# Altium schematic sheet MMC_2_2_MCU.SchDoc
size A4
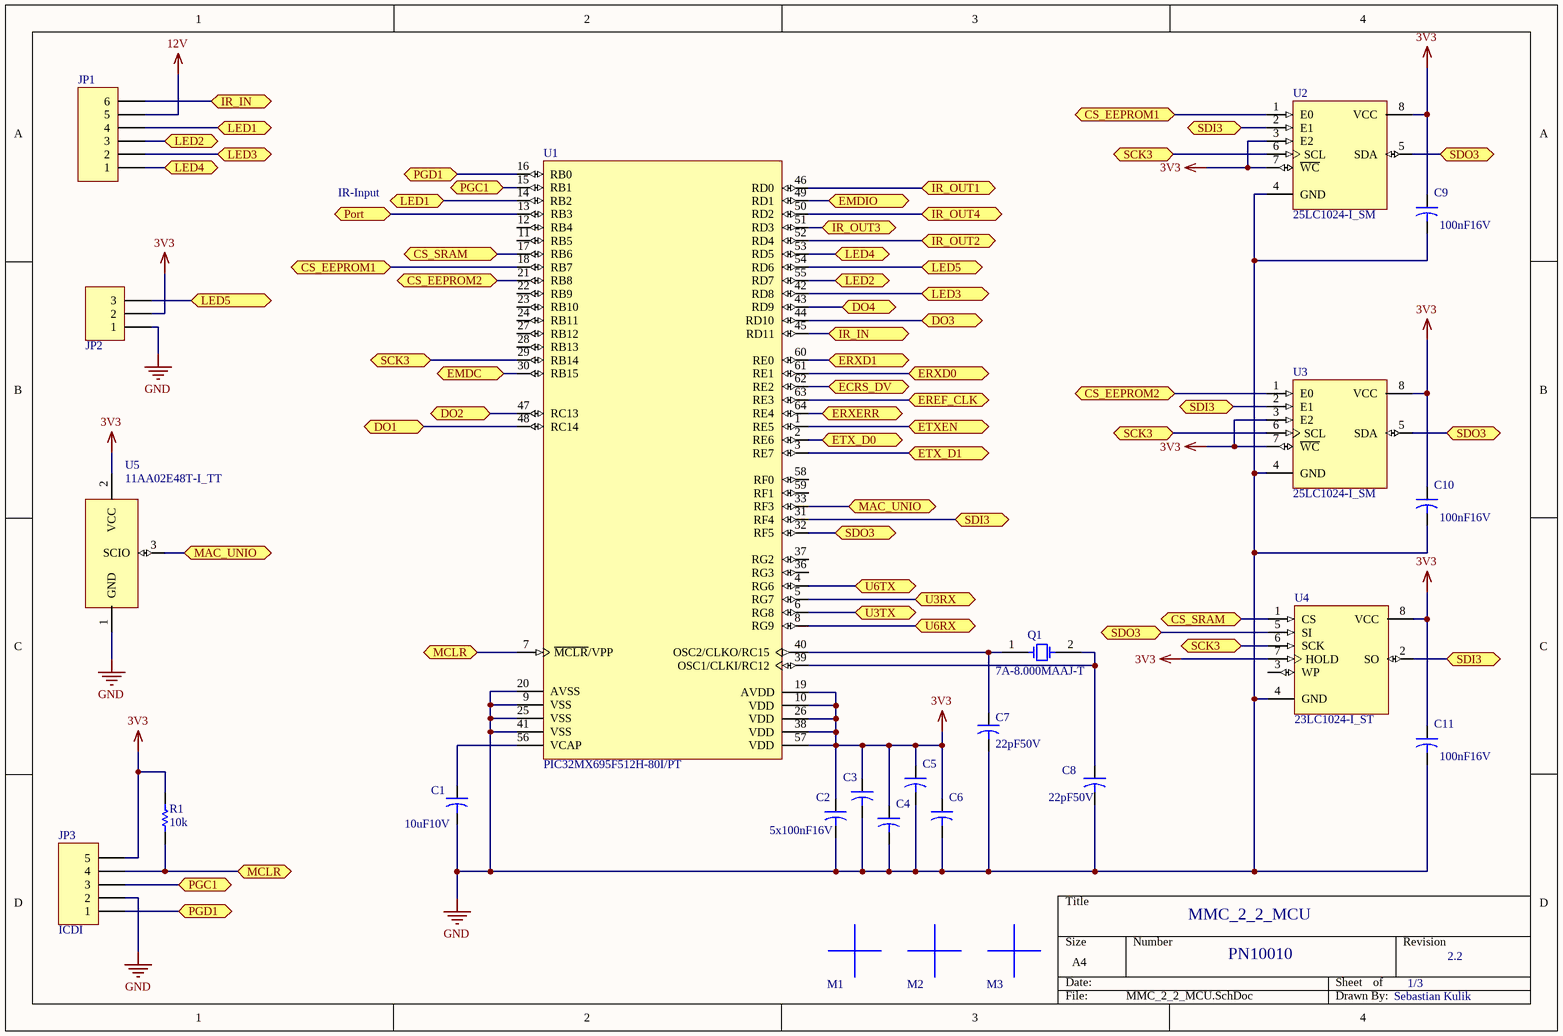
[diagram p0: MMC_2_2_MCU.SchDoc]

## Parts
C1  value 10uF10V  [C0603]  (hidden comment: 10uF10V_0603)
C2  100nF16V_0402  [C0402]  (value not drawn)
C3  100nF16V_0402  [C0402]  (value not drawn)
C4  100nF16V_0402  [C0402]  (value not drawn)
C5  100nF16V_0402  [C0402]  (value not drawn)
C6  100nF16V_0402  [C0402]  (value not drawn)
C7  value 22pF50V  [C0402]  (hidden comment: 22pF50V_0402)
C8  value 22pF50V  [C0402]  (hidden comment: 22pF50V_0402)
C9  value 100nF16V  [C0402]  (hidden comment: 100nF16V_0402)
C10  value 100nF16V  [C0402]  (hidden comment: 100nF16V_0402)
C11  value 100nF16V  [C0402]  (hidden comment: 100nF16V_0402)
JP1  Header 6_2.54  [HDR1X6_2.54]  (value not drawn)
JP2  Header-3  [HDR1X3]  (value not drawn)
JP3  ICDI  [HDR1X5-1.27]
M1  Mark  [Mark-3mm]  (value not drawn)
M2  Mark  [Mark-3mm]  (value not drawn)
M3  Mark  [Mark-3mm]  (value not drawn)
Q1  7A-8.000MAAJ-T  [TXC_7A]
R1  value 10k  [R0402]  (hidden comment: 10k_0402)
U1  PIC32MX695F512H-80I/PT  [TQFP-64_N1]
U2  25LC1024-I_SM  [SOP8_N]
U3  25LC1024-I_SM  [SOP8_N]
U4  23LC1024-I_ST  [TSSOP8]
U5  11AA02E48T-I_TT  [SOT23_M]

## Ports
CS_EEPROM1, CS_EEPROM2, CS_SRAM, DO1, DO2, DO3, DO4, ECRS_DV, EMDC, EMDIO, EREF_CLK, ERXD0, ERXD1, ERXERR, ETX_D0, ETX_D1, ETXEN, IR_IN, IR_OUT1, IR_OUT2, IR_OUT3, IR_OUT4, LED1, LED2, LED3, LED4, LED5, MAC_UNIO, MCLR, PGC1, PGD1, Port, SCK3, SDI3, SDO3, U3RX, U3TX, U6RX, U6TX

## Nets
3V3: C2.1 C3.1 C4.1 C5.1 C6.1 C9.1 C10.1 C11.1 JP2.2 JP3.5 R1.2 U1.10(VDD) U1.19(AVDD) U1.26(VDD) U1.38(VDD) U1.57(VDD) U2.3(E2) U2.7(~{WC}) U2.8(VCC) U3.3(E2) U3.7(~{WC}) U3.8(VCC) U4.7(HOLD) U4.8(VCC) U5.2(VCC)
12V: JP1.5
GND: C1.2 C2.2 C3.2 C4.2 C5.2 C6.2 C7.2 C8.2 C9.2 C10.2 C11.2 JP2.1 JP3.2 U1.9(VSS) U1.20(AVSS) U1.25(VSS) U1.41(VSS) U2.4(GND) U3.4(GND) U4.4(GND) U5.1(GND)
CS_EEPROM1: U1.18(RB7) U2.1(E0) ; port CS_EEPROM1
CS_EEPROM2: U1.21(RB8) U3.1(E0) ; port CS_EEPROM2
CS_SRAM: U1.17(RB6) U4.1(CS) ; port CS_SRAM
DO1: U1.48(RC14) ; port DO1
DO2: U1.47(RC13) ; port DO2
DO3: U1.44(RD10) ; port DO3
DO4: U1.43(RD9) ; port DO4
ECRS_DV: U1.62(RE2) ; port ECRS_DV
EMDC: U1.30(RB15) ; port EMDC
EMDIO: U1.49(RD1) ; port EMDIO
EREF_CLK: U1.63(RE3) ; port EREF_CLK
ERXD0: U1.61(RE1) ; port ERXD0
ERXD1: U1.60(RE0) ; port ERXD1
ERXERR: U1.64(RE4) ; port ERXERR
ETX_D0: U1.2(RE6) ; port ETX_D0
ETX_D1: U1.3(RE7) ; port ETX_D1
ETXEN: U1.1(RE5) ; port ETXEN
IR_IN: JP1.6 U1.45(RD11) ; port IR_IN
IR_OUT1: U1.46(RD0) ; port IR_OUT1
IR_OUT2: U1.52(RD4) ; port IR_OUT2
IR_OUT3: U1.51(RD3) ; port IR_OUT3
IR_OUT4: U1.50(RD2) ; port IR_OUT4
LED1: JP1.4 U1.14(RB2) ; port LED1
LED2: JP1.3 U1.55(RD7) ; port LED2
LED3: JP1.2 U1.42(RD8) ; port LED3
LED4: JP1.1 U1.53(RD5) ; port LED4
LED5: JP2.3 U1.54(RD6) ; port LED5
MAC_UNIO: U1.33(RF3) U5.3(SCIO) ; port MAC_UNIO
MCLR: JP3.4 R1.1 U1.7(~{MCLR}/VPP) ; port MCLR
PGC1: JP3.3 U1.15(RB1) ; port PGC1
PGD1: JP3.1 U1.16(RB0) ; port PGD1
Port: U1.13(RB3) ; port Port
SCK3: U1.29(RB14) U2.6(SCL) U3.6(SCL) U4.6(SCK) ; port SCK3
SDI3: U1.31(RF4) U2.2(E1) U3.2(E1) U4.2(SO) ; port SDI3
SDO3: U1.32(RF5) U2.5(SDA) U3.5(SDA) U4.5(SI) ; port SDO3
U3RX: U1.5(RG7) ; port U3RX
U3TX: U1.6(RG8) ; port U3TX
U6RX: U1.8(RG9) ; port U6RX
U6TX: U1.4(RG6) ; port U6TX
NetC1_1: C1.1 U1.56(VCAP)
NetC7_1: C7.1 Q1.1(E/D) U1.40(OSC2/CLKO/RC15)
NetC8_1: C8.1 Q1.2(GND) U1.39(OSC1/CLKI/RC12)

Not connected (* = marked no-connect by the designer): U1 11(RB5) 12(RB4) 22(RB9) 23(RB10) 24(RB11) 27(RB12) 28(RB13) 36(RG3) 37(RG2) 58(RF0) 59(RF1); U4 3(WP)

## Notes on the sheet
- IR-Input
- (near C2) 5x100nF16V
- MMC_2_2_MCU
- PN10010
- 1/3
- 2.2
- Sebastian Kulik

## Library data of the parts
C1 = 10uF10V_0603: Capacitor; Part Description: AVX ,  X5R, 20%, 10V; Deliverer PartNr: 1867954RL; Manufacturer: AVX; Manufacturer PartNr: 0603ZD106MAT2A; Deliverer: Farnell; TDFE-PN: C0016; Published: 11.02.2014; Publisher: Sebastian Kulik; PackageDescription: C0603
C2-C6 C9-C11 = 100nF16V_0402: Capacitor; Part Description: TDK. CGA series, X7R, 10%, 16V; Deliverer PartNr: 2210748RL; Manufacturer: TDK; Manufacturer PartNr: CGA2B1X7R1C104K050BC; Deliverer: Farnell; TDFE-PN: C0025; Published: 12.02.2014; Publisher: Sebastian Kulik; PackageDescription: C0403
  C2-C6: Value: 100nF16V
C7 C8 = 22pF50V_0402: Murata, GRM series, 50V; Deliverer PartNr: 8819629RL; Manufacturer PartNr: GRM1555C1H220JZ01D; Deliverer: Farnell; TDFE-PN: C0021; Published: 11.02.2014; Part Description: Murata, GRM series, 50V; Publisher: Sebastian Kulik; PackageDescription: C0403; Manufacturer: Murata
JP1 = Header 6_2.54: Header, 6-Pin; LatestRevisionDate: 17-Jul-2002; LatestRevisionNote: Re-released for DXP Platform.; Publisher: Altium Limited
JP2 = Header-3: Header-3-Pin; Publisher: Sebastian Kulik
JP3 = ICDI: Header, 5-Pin; LatestRevisionDate: 17-Jul-2002; LatestRevisionNote: Re-released for DXP Platform.; Publisher: Sebastian Kulik
Q1 = Crystal_8MHz: Crystal, 7A-8.000MAAJ-T; Deliverer PartNr: 1892148; Manufacturer: TXC; Deliverer: Farnell; TDE-PN: P0003; Published: 14.02.2014; PackageReference: 7A; Publisher: Sebastian Kulik; Manufacturer PartNr: 7A-8.000MAAJ-T
R1 = 10k_0402: Vishay CRCW series, 125mW, 1%; Manufacturer PartNr: CRCW040210K0FKEAHP; Deliverer PartNr: 1738864; TDE-PN: R0012; Deliverer: Farnell; Published: 12.02.2014; PackageReference: 0402; Publisher: Sebastian Kulik; PackageDescription: 0402; Manufacturer: Vishay; Part Description: Vishay CRCW series, 125mW, 1%
U1 = PIC32MX695F512H-80I/PT: High Performance ROM-less Microcontroller with External Memory Bus, 1.5K RAM, 64-Pin TQFP, 4.2 to 5.5V Supply Range, Industrial Temperature; Deliverer PartNr: 1778975; Manufacturer: Microchip; Deliverer: Farnell; TDE-PN: IC0031; Published: 11.02.2014; PackageReference: TQFP-64; Publisher: Sebastian Kulik; PackageDescription: 64-Pin Thin Plastic Quad Flat Pack 0.5 mm Pitch, 1.0/0.1 mm Lead Form; Manufacturer PartNr: PIC32MX695F512H-80I/PT
U2 U3 = 25LC1024-I_SM: 1024 Kbit Serial SPI Bus EEPROM; Deliverer PartNr: 1331393; Manufacturer: Microchip; Deliverer: Farnell; TDE-PN: IC0033; Published: 12.02.2014; PackageReference: SOP8; Publisher: Sebastian Kulik; Manufacturer PartNr: 25LC1024-I_SM
U4 = 23LC1024-I_ST: 1 Mbit Serial  EEPROM; Deliverer PartNr: 2212151; Manufacturer PartNr: 23LC1024-I/ST; Manufacturer: Microchip; Deliverer: Farnell; TDE-PN: IC0034; Published: 12.02.2014; PackageReference: TSSOP8; Publisher: Sebastian Kulik
U5 = 11AA02E48T-I_TT: 2 kbit Serial  EEPROM; Deliverer PartNr: 1707616RL; Manufacturer PartNr: 11AA02E48T-I/TT; Manufacturer: Microchip; Deliverer: Farnell; TDE-PN: IC0035; Published: 12.02.2014; PackageReference: SOT23; Publisher: Sebastian Kulik